# EAGLE design lcd13264-module (EAGLE 6.5.0)
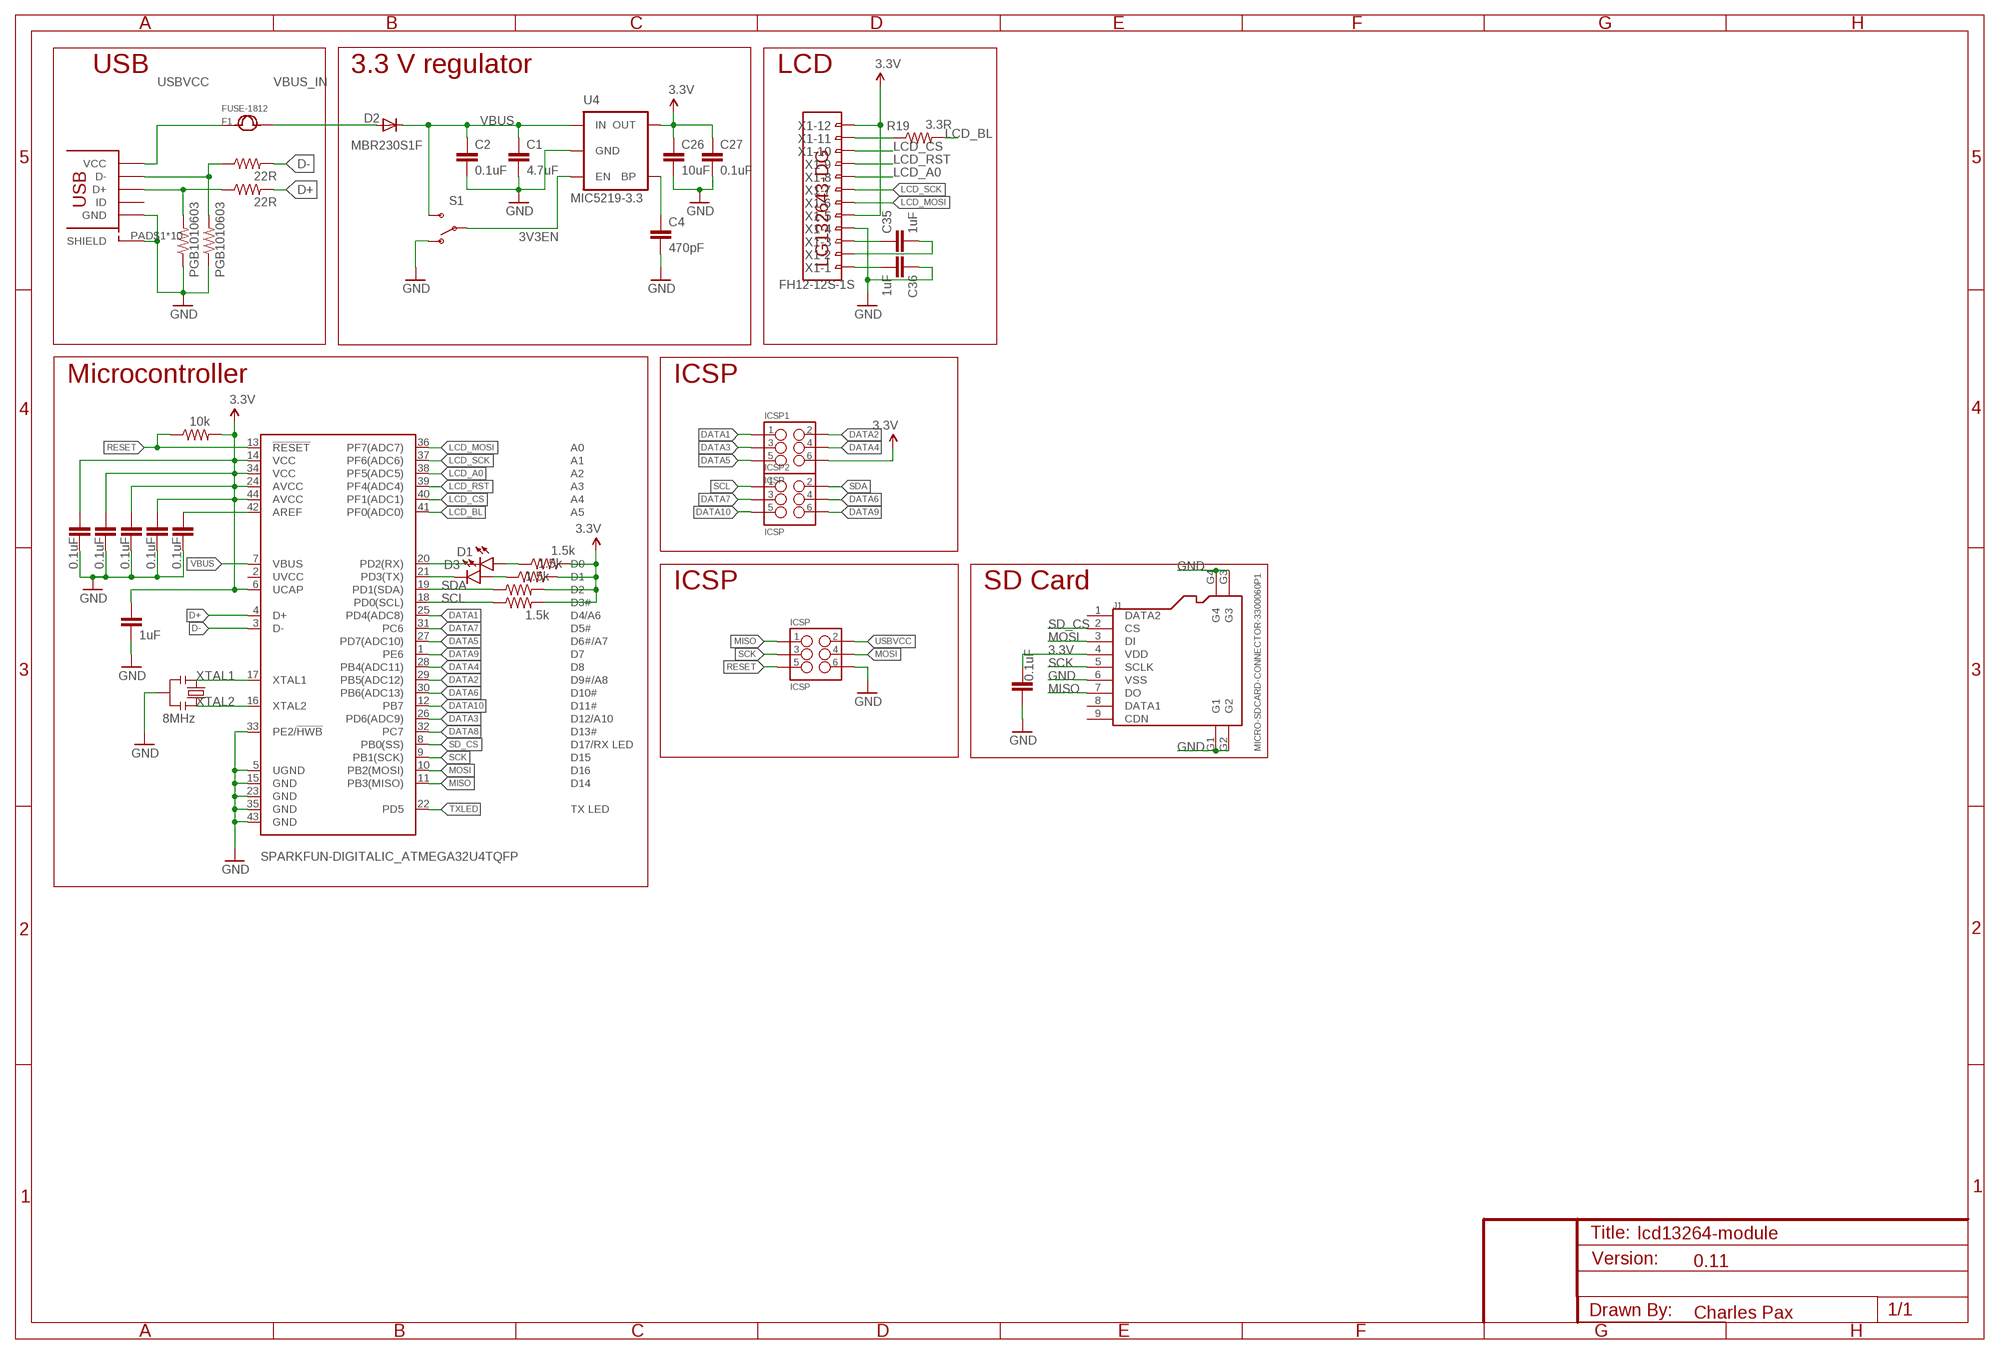
[diagram p0: schematic, sheet 1]

## Parts
C1  4.7uF  SPARKFUN-CAPACITORS_CAP0603-CAP  [SPARKFUN-CAPACITORS_0603-CAP]
C2  0.1uF  SPARKFUN-CAPACITORS_CAP0603-CAP  [SPARKFUN-CAPACITORS_0603-CAP]
C3  0.1uF  SPARKFUN-CAPACITORS_CAP0603-CAP  [SPARKFUN-CAPACITORS_0603-CAP]
C4  470pF  SPARKFUN-CAPACITORS_CAP0603-CAP  [SPARKFUN-CAPACITORS_0603-CAP]
C5  0.1uF  SPARKFUN-CAPACITORS_CAP0603-CAP  [SPARKFUN-CAPACITORS_0603-CAP]
C19  1uF  SPARKFUN-CAPACITORS_CAP0603-CAP  [SPARKFUN-CAPACITORS_0603-CAP]
C21  0.1uF  SPARKFUN-CAPACITORS_CAP0603-CAP  [SPARKFUN-CAPACITORS_0603-CAP]
C26  10uF  SPARKFUN-CAPACITORS_CAP0603-CAP  [SPARKFUN-CAPACITORS_0603-CAP]
C27  0.1uF  SPARKFUN-CAPACITORS_CAP0603-CAP  [SPARKFUN-CAPACITORS_0603-CAP]
C32  0.1uF  SPARKFUN-CAPACITORS_CAP0603-CAP  [SPARKFUN-CAPACITORS_0603-CAP]
C33  0.1uF  SPARKFUN-CAPACITORS_CAP0603-CAP  [SPARKFUN-CAPACITORS_0603-CAP]
C34  0.1uF  SPARKFUN-CAPACITORS_CAP0603-CAP  [SPARKFUN-CAPACITORS_0603-CAP]
C35  1uF  SPARKFUN-CAPACITORS_CAP0603-CAP  [SPARKFUN-CAPACITORS_0603-CAP]
C36  1uF  SPARKFUN-CAPACITORS_CAP0603-CAP  [SPARKFUN-CAPACITORS_0603-CAP]
D1  LED0603  [LED-0603]
D2  MBR230S1F  SPARKFUN-DISCRETESEMI_DIODESOD123SOD123  [SOD123]
D3  LED0603  [LED-0603]
F1  FUSE-1812  [F1812]
ICSP  ICSP  SPARKFUN-CONNECTORS_M03X2PAX  [SPARKFUN-CONNECTORS_2X3_SMT_POSTS_PAXINSTRUMENT]
ICSP1  ICSP  SPARKFUN-CONNECTORS_M03X2PAX  [SPARKFUN-CONNECTORS_2X3_SMT_POSTS_PAXINSTRUMENT]
ICSP2  ICSP  SPARKFUN-CONNECTORS_M03X2PAX  [SPARKFUN-CONNECTORS_2X3_SMT_POSTS_PAXINSTRUMENT]
J1  MICRO-SDCARD-CONNECTOR-3300060P1  [9P-SMD-W-RING]
R1  1.5k  SPARKFUN-RESISTORS_RESISTOR0603-RES  [SPARKFUN-RESISTORS_0603-RES]
R2  1.5k  SPARKFUN-RESISTORS_RESISTOR0603-RES  [SPARKFUN-RESISTORS_0603-RES]
R4  10k  SPARKFUN-RESISTORS_RESISTOR0603-RES  [SPARKFUN-RESISTORS_0603-RES]
R9  22R  SPARKFUN-RESISTORS_RESISTOR0603-RES  [SPARKFUN-RESISTORS_0603-RES]
R10  22R  SPARKFUN-RESISTORS_RESISTOR0603-RES  [SPARKFUN-RESISTORS_0603-RES]
R13  1.5k  SPARKFUN-RESISTORS_RESISTOR0603-RES  [SPARKFUN-RESISTORS_0603-RES]
R14  1.5k  SPARKFUN-RESISTORS_RESISTOR0603-RES  [SPARKFUN-RESISTORS_0603-RES]
R19  3.3R  SPARKFUN-RESISTORS_RESISTOR0603-RES  [SPARKFUN-RESISTORS_0603-RES]
S1  SWITCH-SPDT-SMD-A  [SWITCH-SPST-SMD-A]
U4  MIC5219-3.3V  V_REG_LDOSMD  [SOT23-5]
U$1  USB_MICROSMT+THRUHULE  [USB_MICRO_THRUHOLE]
U$3  SPARKFUN-DIGITALIC_ATMEGA32U4TQFP  [SPARKFUN-DIGITALIC_SPARKFUN-DIGITALIC_TQFP44]
U$5  LG132643-DG  [LG132643-DG]
X1  FH12-12S-1S  [FH12-12S-1SH]
Y1  RESONATORSMD  [RESONATOR-SMD]
Z1  PGB1010603  SPARKFUN-RESISTORS_RESISTOR0603-RES  [SPARKFUN-RESISTORS_0603-RES]
Z2  PGB1010603  SPARKFUN-RESISTORS_RESISTOR0603-RES  [SPARKFUN-RESISTORS_0603-RES]

## Nets
3.3V: C5.1 C19.1 C21.2 C26.1 C27.1 C32.1 C33.1 C34.1 ICSP1.6 J1.4(VDD) R1.2 R2.2 R4.2 R13.2 R14.2 U4.5(OUT) U$3.6(UCAP) U$3.14(VCC) U$3.24(AVCC) U$3.34(VCC) U$3.44(AVCC) X1.5 X1.12
3V3EN: S1.2(P) U4.3(EN)
D+: R9.2 U$3.4(D+)
D-: R10.2 U$3.3(D-)
DATA1: ICSP1.1 U$3.25(PD4(ADC8))
DATA2: ICSP1.2 U$3.29(PB5(ADC12))
DATA3: ICSP1.3 U$3.26(PD6(ADC9))
DATA4: ICSP1.4 U$3.28(PB4(ADC11))
DATA5: ICSP1.5 U$3.27(PD7(ADC10))
DATA6: ICSP2.4 U$3.30(PB6(ADC13))
DATA7: ICSP2.3 U$3.31(PC6)
DATA8: U$3.32(PC7)
DATA9: ICSP2.6 U$3.1(PE6)
DATA10: ICSP2.5 U$3.12(PB7)
GND: C1.2 C2.2 C3.2 C4.2 C5.2 C19.2 C21.1 C26.2 C27.2 C32.2 C33.2 C34.2 C36.1 ICSP.6 J1.6(VSS) J1.G1 J1.G2 J1.G3 J1.G4 S1.1(O) U4.2(GND) U$1.PAD$1(SHIELD) U$1.PAD$2(SHIELD) U$1.PAD$3(SHIELD) U$1.PAD$4(SHIELD) U$1.PAD$5(SHIELD) U$1.PAD$6(SHIELD) U$1.PAD$7(SHIELD) U$1.PAD$8(SHIELD) U$1.PAD$9(SHIELD) U$1.PAD$10(SHIELD) U$1.PIN$5(GND) U$3.5(UGND) U$3.15(GND) U$3.23(GND) U$3.33(PE2/!HWB) U$3.35(GND) U$3.43(GND) X1.4 Y1.2 Z1.1 Z2.1
LCD_A0: U$3.38(PF5(ADC5)) X1.8
LCD_BL: R19.2 U$3.41(PF0(ADC0))
LCD_CS: U$3.40(PF1(ADC1)) X1.10
LCD_MOSI: U$3.36(PF7(ADC7)) X1.6
LCD_RST: U$3.39(PF4(ADC4)) X1.9
LCD_SCK: U$3.37(PF6(ADC6)) X1.7
MISO: ICSP.1 J1.7(DO) U$3.11(PB3(MISO))
MOSI: ICSP.4 J1.3(DI) U$3.10(PB2(MOSI))
N$1: C4.1 U4.4(BP)
N$2: D3.C U$3.21(PD3(TX))
N$4: R19.1 X1.11
N$5: D1.C U$3.20(PD2(RX))
N$7: D3.A R1.1
N$10: D1.A R2.1
N$15: C3.1 U$3.42(AREF)
N$31: R10.1 U$1.PIN$2(D-) Z2.2
N$33: R9.1 U$1.PIN$3(D+) Z1.2
N$37: C35.1 X1.3
N$38: C35.2 X1.2
N$39: C36.2 X1.1
RESET: ICSP.5 R4.1 U$3.13(!RESET)
SCK: ICSP.3 J1.5(SCLK) U$3.9(PB1(SCK))
SCL: ICSP2.1 R14.1 U$3.18(PD0(SCL))
SD_CS: J1.2(CS) U$3.8(PB0(SS))
SDA: ICSP2.2 R13.1 U$3.19(PD1(SDA))
TXLED: U$3.22(PD5)
USBVCC [power]: F1.1 ICSP.2 U$1.PIN$1(VCC)
VBUS [power]: C1.1 C2.1 D2.C S1.3(S) U4.1(IN) U$3.7(VBUS)
VBUS_IN [power]: D2.A F1.2
XTAL1: U$3.17(XTAL1) Y1.1
XTAL2: U$3.16(XTAL2) Y1.3
Unconnected: J1.1(DATA2) J1.8(DATA1) J1.9(CDN) U$1.PIN$4(ID) U$3.2(UVCC)

## Notes on the sheet
- USB | 3.3 V regulator | LCD
- MIC5219-3.3
- Microcontroller | ICSP
- ICSP | SD Card
- 8MHz
- 0.11
- Charles Pax

## Library data of the parts
C1 = PaxInstrument-T400:SPARKFUN-CAPACITORS_CAP: Capacitor Standard 0603 ceramic capacitor, and 0.1" leaded capacitor.; MPN: GRM188R60J475KE19D; OC_DIGIKEY: 490-3297-2-ND
C2 C3 C5 C21 C27 C32-C34 = PaxInstrument-T400:SPARKFUN-CAPACITORS_CAP: Capacitor Standard 0603 ceramic capacitor, and 0.1" leaded capacitor.; MPN: CL10B104KO8NNNC; OC_DIGIKEY: 1276-1005-2-ND
C4 = PaxInstrument-T400:SPARKFUN-CAPACITORS_CAP: Capacitor Standard 0603 ceramic capacitor, and 0.1" leaded capacitor.; MPN: C1608X5R1A474K080AA; OC_DIGIKEY: 445-1320-2-ND
C19 C35 C36 = PaxInstrument-T400:SPARKFUN-CAPACITORS_CAP: Capacitor Standard 0603 ceramic capacitor, and 0.1" leaded capacitor.; MPN: LMK107B7105KA-T; OC_DIGIKEY: 587-1242-2-ND
C26 = PaxInstrument-T400:SPARKFUN-CAPACITORS_CAP: Capacitor Standard 0603 ceramic capacitor, and 0.1" leaded capacitor.; MPN: JMK107ABJ106MAHT; OC_DIGIKEY: 587-3383-2-ND
D1 D3 = SparkFun-LED:LED: LEDs Standard schematic elements and footprints for 5mm, 3mm, 1206, and 0603 sized LEDs. 5mm - Spark Fun Electronics SKU : COM-00529 (and others)
D2 = PaxInstrument-T400:SPARKFUN-DISCRETESEMI_DIODE: Diode These are standard reverse protection diodes and small signal diodes. SMA package can handle up to about 1A. SOD-323 can handle about 200mA. What the SOD-323 package when ordering, there are some mfgs out there that are 5-pin packages.; MPN: B340A-13-F; OC_DIGIKEY: B340A-FDICT-ND
F1 = PaxInstrument-T400:FUSE*
ICSP ICSP1 ICSP2 = PaxInstrument-T400:SPARKFUN-CONNECTORS_M03X2: 2x3 .1" header. Shrouded, with keying- CONN-10681 SMT- CONN-11415 Pogo pins- HW-11044; MPN: 95278-101A06LF; OC_DIGIKEY: 609-3487-2-ND
J1 = PaxInstrument-T400:MICRO-SDCARD-CONNECTOR: Micro SD Card
R1 R2 R13 R14 = PaxInstrument-T400:SPARKFUN-RESISTORS_RESISTOR: Resistor Basic schematic elements and footprints for 0603, 1206, and PTH resistors.; MPN: RC0603JR-071K5L; OC_DIGIKEY: 311-1.5KGRTR-ND
R4 = PaxInstrument-T400:SPARKFUN-RESISTORS_RESISTOR: Resistor Basic schematic elements and footprints for 0603, 1206, and PTH resistors.; MPN: RC1608J103CS; OC_DIGIKEY: 1276-5086-2-ND
R9 R10 = PaxInstrument-T400:SPARKFUN-RESISTORS_RESISTOR: Resistor Basic schematic elements and footprints for 0603, 1206, and PTH resistors.; MPN: RC0603JR-0722RL; OC_DIGIKEY: 311-22GRTR-ND
R19 = PaxInstrument-T400:SPARKFUN-RESISTORS_RESISTOR: Resistor Basic schematic elements and footprints for 0603, 1206, and PTH resistors.
S1 = SparkFun-Electromechanical:SWITCH-SPDT: SPDT Switch Simple slide switch, Spark Fun Electronics SKU : COM-00102 DPDT SMT slide switch, AYZ0202, SWCH-08179
U4 = SparkFun:V_REG_LDO: Voltage Regulator LDO Standard 150mA LDO voltage regulator in SOT-23 layout. Micrel part MIC5205. BP (by-pass) pin is used to lower output noise with 470pF cap.; MPN: MIC5219-3.3YM5 TR; OC_DIGIKEY: 576-1281-2-ND
U$1 = blinkinlabs:USB_MICRO; MPN: 10118194-0001LF; OC_DIGIKEY: 609-4618-2-ND
U$3 = PaxInstrument-T400:SPARKFUN-DIGITALIC_ATMEGA32U4: Atmel 44-pin 8-bit Microcontroller with 32KBytes of ISP Flash and USB Controller ----- Please use the QFN-44-NOPAD_1:1 package for the footprint of all boards using a 32U4. Route traces directly away from the pads as much as possible.
U$5 = charlespax:LG132643-DG; MPN: LG132643-DW
X1 = PaxInstrument-T400:FH12-12S-1S
Y1 = SparkFun:RESONATOR: Resonator Small SMD resonator. This is the itty bitty 10/20MHz resonators with built in caps. CSTCE10M0G55 and CSTCE20M0V53. Footprint has been reviewed closely but hasn't been tested yet.; MPN: CSTCE8M00G52-R0; OC_DIGIKEY: 490-5994-2-ND
Z1 Z2 = PaxInstrument-T400:SPARKFUN-RESISTORS_RESISTOR: Resistor Basic schematic elements and footprints for 0603, 1206, and PTH resistors.; MPN: PGB1010603NRHF; OC_DIGIKEY: F4239CT-ND

## Net classes
0 default: width 0.203 mm, drill 0.33 mm
1 power: width 0.305 mm

## Board
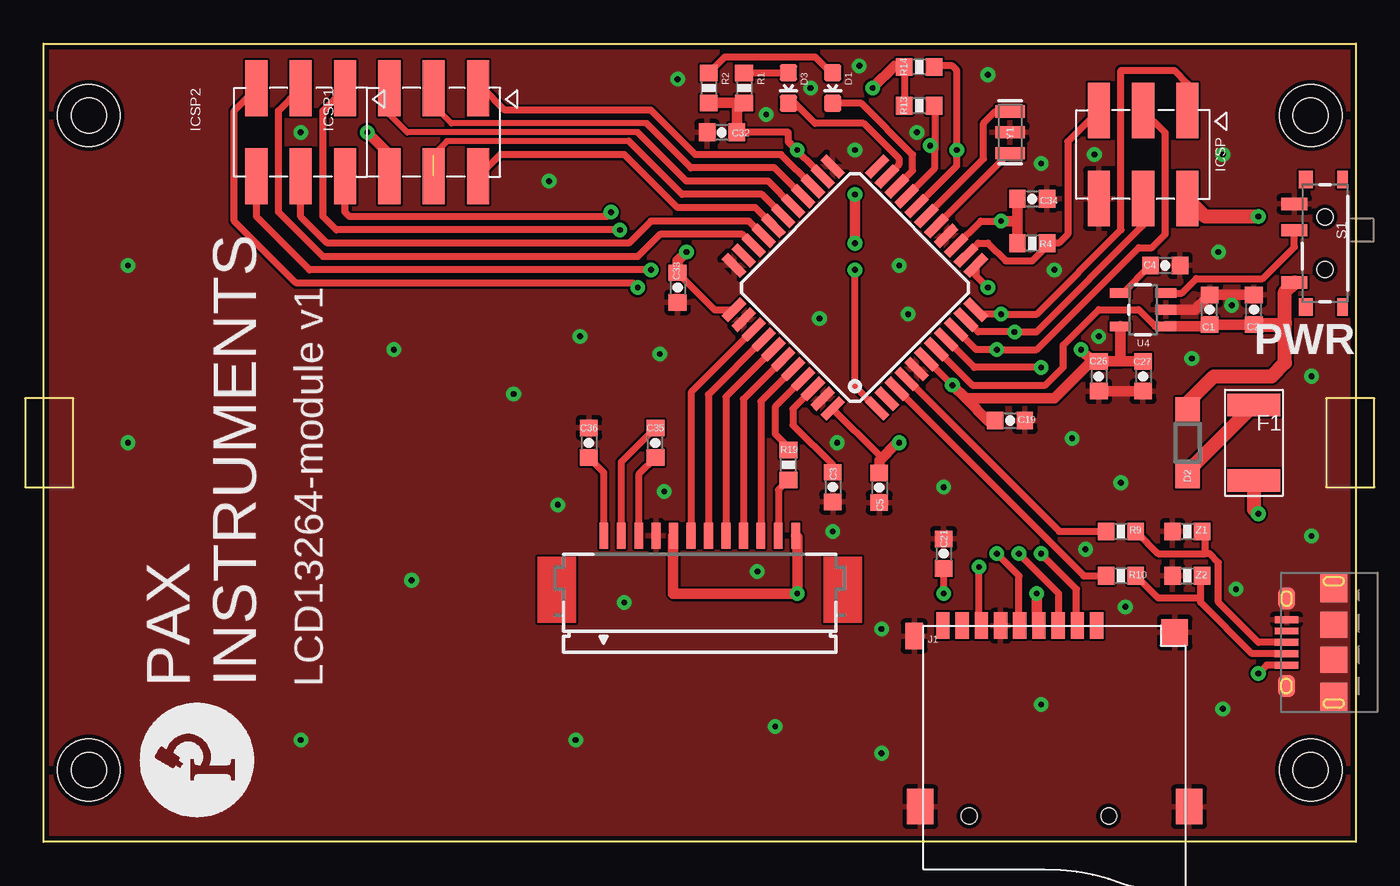
[diagram p1: board, top side]
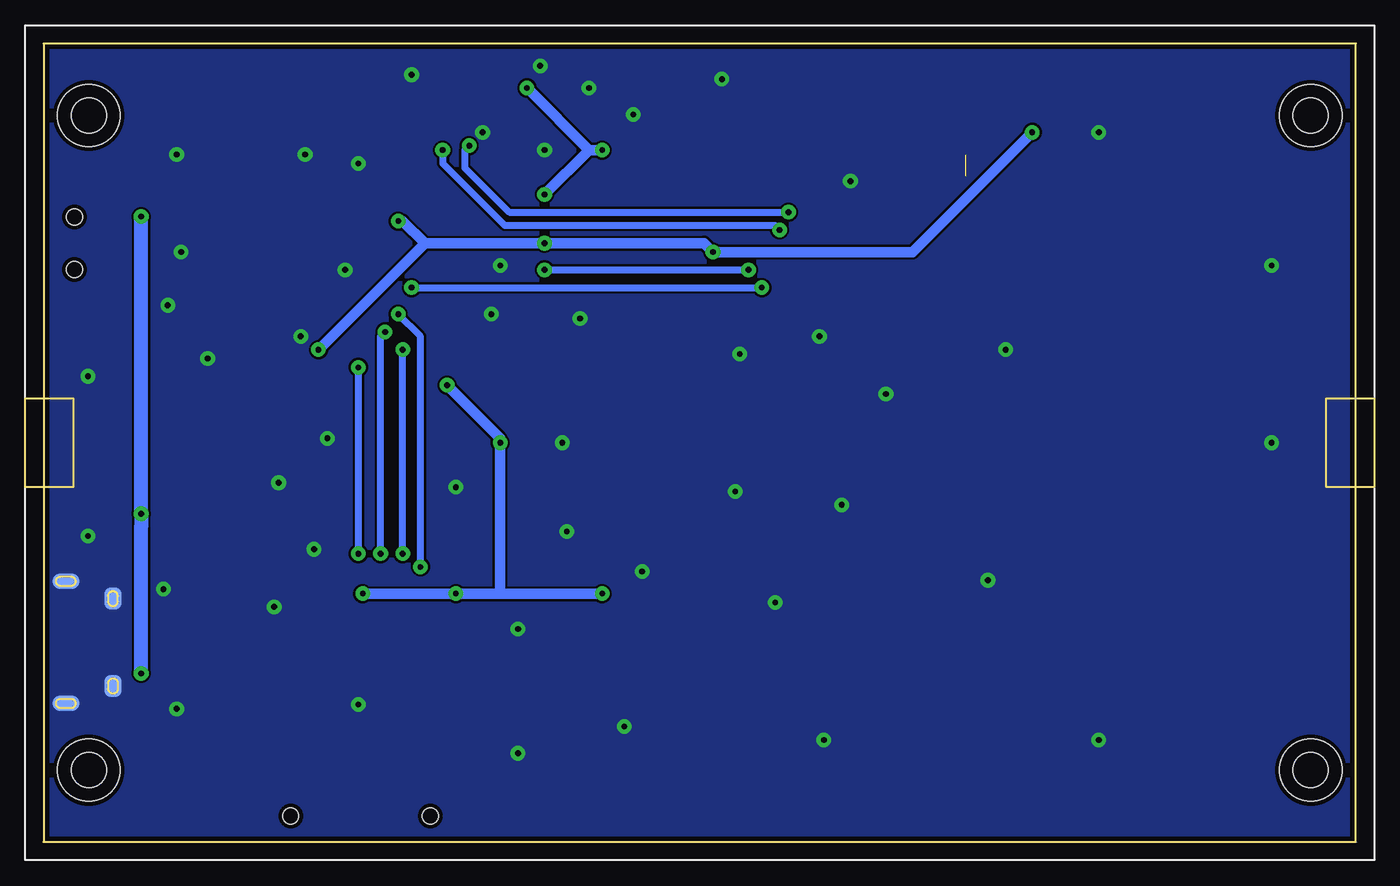
[diagram p2: board, bottom side, seen from below]

Size 75.18 x 45.72 mm. Coordinates in mm from the lower left corner, seen from the top.
Outline: 75.18,0 0,0 0,45.72 75.18,45.72 75.18,0
Copper layers (1*16): Top 0.035mm / dielectric 1.5mm / Bottom 0.035mm
Design rules "PaxInstrument-T400 *": minimum track width 6mil, minimum drill 13mil, track to track 5mil, track to pad 5mil, pad to pad 5mil, via to via 5mil, smd to smd 5mil, copper to edge 10mil, drill to drill 8mil, minimum pad ring 12mil, minimum via ring 10mil, stop-mask expansion 4mil, vias tented up to drill 25mil, thermal gap 10mil
Holes 3.56 mm at 2.59,41.61 2.59,4.11 72.59,4.11 72.59,41.61

### Footprints (pad centres in the part's own frame; a part is rotated, then mirrored left to right if it is on the bottom)
SPARKFUN-CAPACITORS_0603-CAP = smd 0.94 x 1.016: 1 -0.85,0; 2 0.85,0
LED-0603 = smd 1 x 1: A 0,-0.877; C 0,0.877
SOD123 = smd 1.4 x 1.4: A 1.9,0; C -1.9,0
F1812 = smd 1.27 x 3.048: 1 -2.159,0; 2 2.159,0
SPARKFUN-CONNECTORS_2X3_SMT_POSTS_PAXINSTRUMENT = smd 1.27 x 3.2: 1 -2.54,-2.52; 2 -2.54,2.52; 3 0,-2.52; 4 0,2.52; 5 2.54,-2.52; 6 2.54,2.52
9P-SMD-W-RING = smd 1.524 x 0.762: 1 -7.493,2.414; 2 -7.493,1.314; 3 -7.493,0.214; 4 -7.493,-0.886; 5 -7.493,-1.986; 6 -7.493,-3.086; 7 -7.493,-4.186; 8 -7.493,-5.286; 9 -7.493,-6.386 | smd 1.524 x 1.016: G1 -6.893,-8.032 | smd 2.032 x 1.524: G2 2.88,-7.686; G3 2.88,7.714 | smd 1.524 x 1.524: G4 -7.101,6.895 | hole 0.889: 3.407,-4.886; 3.407,3.114
SPARKFUN-RESISTORS_0603-RES = smd 0.94 x 1.016: 1 -0.85,0; 2 0.85,0
SWITCH-SPST-SMD-A = smd 0.7 x 1.5: 1 -2.25,-1.75; 2 -0.75,-1.75; 3 2.25,-1.75 | smd 1 x 0.6: GND1 -3.65,1; GND3 3.65,1 | smd 1 x 0.8: GND2 -3.65,-1.1; GND4 3.65,-1.1 | hole 0.9: -1.5,0; 1.5,0
SOT23-5 = smd 0.55 x 1.2: 1 -0.95,-1.3; 2 0,-1.3; 3 0.95,-1.3; 4 0.95,1.3; 5 -0.95,1.3
USB_MICRO_THRUHOLE = smd 1.645 x 1.55: PAD$1 -3.123,0; PAD$4 3.123,0 | smd 1.5 x 1.55: PAD$2 -1,0; PAD$3 1,0 | smd 1.25 x 0.95: PAD$5 -2.5,2.7; PAD$6 2.5,2.7 | smd 0.9 x 1.55 bottom: PAD$7 -3.5,0; PAD$8 3.5,0 | smd 1.25 x 0.95 bottom: PAD$9 -2.5,2.7; PAD$10 2.5,2.7 | smd 0.4 x 1.35: PIN$1 -1.3,2.7; PIN$2 -0.65,2.7; PIN$3 0,2.7; PIN$4 0.65,2.7; PIN$5 1.3,2.7
SPARKFUN-DIGITALIC_SPARKFUN-DIGITALIC_TQFP44 = smd 1.5 x 0.5: 1 -5.8,4; 2 -5.8,3.2; 3 -5.8,2.4; 4 -5.8,1.6; 5 -5.8,0.8; 6 -5.8,0; 7 -5.8,-0.8; 8 -5.8,-1.6; 9 -5.8,-2.4; 10 -5.8,-3.2; 11 -5.8,-4; 23 5.8,-4; 24 5.8,-3.2; 25 5.8,-2.4; 26 5.8,-1.6; 27 5.8,-0.8; 28 5.8,0; 29 5.8,0.8; 30 5.8,1.6; 31 5.8,2.4; 32 5.8,3.2; 33 5.8,4 | smd 0.5 x 1.5: 12 -4,-5.8; 13 -3.2,-5.8; 14 -2.4,-5.8; 15 -1.6,-5.8; 16 -0.8,-5.8; 17 0,-5.8; 18 0.8,-5.8; 19 1.6,-5.8; 20 2.4,-5.8; 21 3.2,-5.8; 22 4,-5.8; 34 4,5.8; 35 3.2,5.8; 36 2.4,5.8; 37 1.6,5.8; 38 0.8,5.8; 39 0,5.8; 40 -0.8,5.8; 41 -1.6,5.8; 42 -2.4,5.8; 43 -3.2,5.8; 44 -4,5.8
LG132643-DG = hole 2: -35,-18.75; 35,-18.75; 35,18.75; -35,18.75
FH12-12S-1SH = smd 0.5 x 1.5: 1 -5.5,2.297; 2 -4.5,2.297; 3 -3.5,2.297; 4 -2.5,2.297; 5 -1.5,2.297; 6 -0.5,2.297; 7 0.5,2.297; 8 1.5,2.297; 9 2.5,2.297; 10 3.5,2.297; 11 4.5,2.297; 12 5.5,2.297
RESONATOR-SMD = smd 0.7 x 1.7: 1 -1.2,0; 2 0,0; 3 1.2,0

### Placement (x,y rotation side)
C1  66.8,30.48 90 top
C2  69.34,30.48 90 top
C3  45.21,20.32 270 top
C4  64.26,33.02 0 top
C5  47.88,20.29 270 top
C19  55.37,24.13 0 top
C21  51.56,16.51 270 top
C26  60.45,26.67 270 top
C27  62.99,26.67 270 top
C32  38.86,40.64 180 top
C33  36.32,31.75 270 top
C34  56.64,36.83 0 top
C35  35.05,22.86 90 top
C36  31.24,22.86 270 top
D1  45.21,43.18 180 top
D2  65.53,22.86 270 top
D3  42.67,43.18 180 top
F1  69.34,22.86 90 top
ICSP  62.99,39.37 180 top
ICSP1  22.35,40.64 180 top
ICSP2  14.73,40.64 180 top
J1  57.91,4.89 270 top
R1  40.13,43.18 270 top
R2  38.1,43.18 270 top
R4  56.64,34.29 180 top
R9  61.72,17.78 180 top
R10  61.72,15.24 180 top
R13  50.16,42.16 180 top
R14  50.16,44.39 180 top
R19  42.67,21.59 90 top
S1  73.41,34.29 270 top
U4  62.99,30.48 90 top
U$1  73.91,11.43 90 top
U$3  46.48,31.75 135 top
U$5  37.59,22.86 0 top
U$6  [PAXINSTRUMENT_LOGO]  12.19,1.27 90 top
X1  37.59,15.24 0 top
Y1  55.37,40.64 270 top
Z1  65.53,17.78 0 top
Z2  65.53,15.24 0 top

### Tracks (layer width: path | path; a pad name or v marks a point on that pad's centre or on a via)
3.3V  (via drill 0.33)
  Top 0.406: U$3.6 v52.07,26.16 | C5.1 47.88,22.15 U$3.44 | C33.1 38.45,30.48 U$3.34 | U$3.24 42.67,40.08 | 42.67,40.08 42.72,40.08 v43.18,39.62 | U$3.14 53.69,35.56 v54.86,35.56 | C21.2 v51.56,14.22 | C32.1 42.67,40.64 42.67,40.08 | R14.2 R13.2
  Top 0.457: 36.07,17.51 X1.5
  Top 0.61: J1.4 56.9,12.52 v56.9,14.22 | 36.07,17.51 36.07,14.22 v43.18,14.22 43.18,17.45 X1.12 | v49.02,22.86 48.9,22.86 47.88,21.84 C5.1 | C27.1 C26.1 | v52.07,26.16 52.83,25.4 | 52.83,25.4 57.91,25.4 60.03,27.52 60.11,27.52 | C19.1 54.1,24.13 52.83,25.4 | C26.1 60.11,27.52 | 60.11,27.52 v59.44,28.19 | C26.1 61.69,27.52 U4.5 | C34.1 R4.2 55.79,35.39 arc90 55.63,35.56 v54.86,35.56 | v46.48,34.29 v46.48,37.08 | R2.2 R1.2 39.71,41.91 C32.1 | v47.5,43.18 48.77,44.45 48.83,44.39 R14.2 | C33.1 36.32,33.27 v36.83,33.78 | ICSP1.6 19.81,39.37 v18.54,40.64
  Bottom 0.61: v56.9,14.22 v51.56,14.22 49.02,14.22 | 49.02,14.22 v43.18,14.22 | 49.02,14.22 v49.02,22.86 49.02,23.11 v52.07,26.16 | 53.34,34.29 v46.48,34.29 37.34,34.29 v36.83,33.78 25.4,33.78 v18.54,40.64 | v59.44,28.19 53.34,34.29 | v54.86,35.56 54.61,35.56 53.34,34.29 | v46.48,37.08 43.94,39.62 | v43.18,39.62 43.94,39.62 | 43.94,39.62 v47.5,43.18
3V3EN
  Top 0.406: S1.2 71.66,34.06 69.85,32.26 66.04,32.26 65.21,31.43 U4.3
D+
  Top 0.406: U$3.4 58.19,17.78 R9.2
D-
  Top 0.406: U$3.3 59.6,15.24 R10.2
DATA1
  Top 0.406: U$3.25 42.26,39.37 37.34,39.37 34.8,41.91 26.42,41.91 25.17,43.16 ICSP1.1 24.89,42.93
DATA2
  Top 0.406: U$3.29 40.78,36.32 36.32,36.32 33.27,39.37 26.16,39.37 24.91,38.12 ICSP1.2
DATA3
  Top 0.33: 34.54,41.15 23.37,41.15 22.35,42.16 ICSP1.3
  Top 0.406: U$3.26 41.89,38.61 37.08,38.61 34.54,41.15
DATA4  (1 unrouted)
  Top 0.33: 33.53,40.13 23.11,40.13 22.35,39.37
  Top 0.406: U$3.28 41.15,37.08 36.58,37.08 33.53,40.13
DATA5
  Top 0.33: 34.04,40.64 20.83,40.64 19.81,41.66 19.81,42.67
  Top 0.406: 19.81,42.67 ICSP1.5 | U$3.27 41.52,37.85 36.83,37.85 34.04,40.64
DATA6
  Top 0.406: U$3.30 40.41,35.56 34.8,35.56 33.53,34.29 16.26,34.29 14.73,35.81 ICSP2.4
DATA7
  Top 0.406: U$3.31 40.04,34.8 35.31,34.8 34.04,33.53 16,33.53 13.46,36.07 13.46,41.89 ICSP2.3
DATA9  (via drill 0.33)
  Top 0.406: U$3.1 46.48,26.09 v46.48,32.77 | v34.8,32.77 15.24,32.77 12.19,35.81 ICSP2.6
  Bottom 0.406: v46.48,32.77 v34.8,32.77
DATA10  (via drill 0.33)
  Top 0.406: U$3.12 53.41,32.44 v54.1,31.75 | v34.04,31.75 33.78,32 14.48,32 10.92,35.56 10.92,41.89 ICSP2.5
  Bottom 0.406: v54.1,31.75 v34.04,31.75
GND  (via drill 0.33)
  Top 0.61: C2.2 C1.2 65.95,30.48 U4.2 | C27.2 C26.2
  other vias: 68.07,30.73 67.31,33.78 57.91,32.77 49.53,30.23 44.45,29.97 49.02,33.02 46.48,39.62 50.04,40.64 46.74,44.45 43.94,43.18 41.4,41.66 36.32,43.69 54.1,43.94 57.15,38.86 60.2,39.37 67.56,39.37 65.79,27.69 58.93,23.11 45.47,22.86 45.21,17.78 51.56,20.32 59.69,16.76 61.98,13.46 48.01,12.19 40.89,15.49 68.33,14.48 72.64,17.53 72.64,26.67 67.56,7.62 41.91,6.6 30.48,5.84 14.73,5.84 4.83,22.86 4.83,33.02 20.07,28.19 21.08,14.99 26.92,25.65 35.56,20.07 33.27,13.72 29.46,19.3 35.31,27.94 57.15,7.87 48.01,5.08 61.72,20.57 28.96,37.85 14.73,40.64 60.45,28.96 30.73,28.96
  pour Bottom: 74.93,45.47 74.93,0.25 0.25,0.25 0.25,45.47
  pour Top: 74.93,45.47 74.93,0.25 0.25,0.25 0.25,45.47
LCD_A0
  Top 0.406: U$3.38 39.09,25.49 X1.8
LCD_BL
  Top 0.406: U$3.41 41.91,24.91 41.91,23.37 42.67,22.61 R19.2
LCD_CS
  Top 0.406: U$3.40 41.09,25.23 X1.10
LCD_MOSI
  Top 0.406: U$3.36 37.09,25.75 X1.6
LCD_RST
  Top 0.406: U$3.39 40.09,25.36 X1.9
LCD_SCK
  Top 0.406: U$3.37 38.09,25.62 X1.7
MISO  (via drill 0.33)
  Top 0.406: J1.7 53.73,12.82 53.59,12.95 v53.59,15.75 | U$3.11 53.66,30.23 v54.86,30.23 56.9,30.23 61.72,35.05 61.72,44.2 64.77,44.2 65.53,43.43 ICSP.1
  Bottom 0.406: v53.59,15.75 53.59,28.96 v54.86,30.23
MOSI  (via drill 0.33)
  Top 0.406: J1.3 58.13,12.66 58.17,12.7 58.17,14.22 v55.88,16.51 | U$3.10 53.55,29.21 v55.63,29.21 56.9,29.21 62.99,35.31 ICSP.4
  Bottom 0.406: v55.88,16.51 55.88,28.96 v55.63,29.21
N$1
  Top 0.406: U4.4 61.82,31.43 C4.1
N$2
  Top 0.406: U$3.21 49.02,38.81 49.02,39.12 46.99,41.15 44.2,41.15 43.04,42.3 D3.C
N$4
  Top 0.406: R19.1 42.09,20.16 X1.11
N$5
  Top 0.406: U$3.20 49.78,38.45 49.78,39.37 46.85,42.3 D1.C
N$7
  Top 0.406: R1.1 40.16,44.06 D3.A
N$10
  Top 0.406: R2.1 39.03,44.96 44.2,44.96 45.1,44.06 D1.A
N$15
  Top 0.406: U$3.42 42.93,24.8 42.93,23.88 45.21,21.59 C3.1
N$31
  Top 0.406: U$1.PIN$2 69.23,10.78 66.29,13.72 66.29,13.97 | 66.29,13.97 66.29,15.15 Z2.2 | R10.1 63.84,13.97 66.29,13.97
N$33
  Top 0.406: U$1.PIN$3 69.6,11.43 67.31,13.72 67.31,16 66.8,16.51 66.55,16.51 | R9.1 63.84,16.51 66.55,16.51 | 66.55,16.51 66.55,17.61 Z1.2
N$37
  Top 0.406: C35.1 34.09,21.05 X1.3
N$38
  Top 0.406: C35.2 33.09,21.75 X1.2
N$39
  Top 0.406: C36.2 32.09,21.16 X1.1
RESET
  Top 0.406: U$3.13 53.55,34.29 54.1,34.29 55.12,33.27 56.64,33.27 57.49,34.12 R4.1 58.17,34.29 58.67,34.8 58.67,40.11 ICSP.5
SCK  (via drill 0.33)
  Top 0.406: J1.5 55.93,12.91 55.88,12.95 55.88,15.24 v54.61,16.51 | U$3.9 53.43,28.19 v54.61,28.19 56.9,28.19 62.74,34.04 63.5,34.04 64.26,34.8 64.26,40.62 ICSP.3
  Bottom 0.406: v54.61,16.51 v54.61,28.19
SCL  (via drill 0.33)
  Top 0.406: U$3.18 52.32,38.72 v52.32,39.62 52.32,44.2 52.07,44.45 51.08,44.45 R14.1 | v33.02,35.05 16.76,35.05 16,35.81 16,41.89 ICSP2.1
  Bottom 0.406: v52.32,39.62 52.32,38.86 48.77,35.31 33.27,35.31 v33.02,35.05
SD_CS  (via drill 0.33)
  Top 0.406: J1.2 59.23,12.66 59.18,12.7 59.18,14.48 v57.15,16.51 | v57.15,27.18 53.32,27.18 U$3.8
  Bottom 0.406: v57.15,16.51 v57.15,27.18
SDA  (via drill 0.33)
  Top 0.406: U$3.19 51.05,38.58 51.05,39.62 | 51.05,39.62 v50.8,39.88 | 51.05,39.62 51.05,42.12 R13.1 | v32.51,36.07 32.26,35.81 17.53,35.81 17.27,36.07 ICSP2.2
  Bottom 0.406: v50.8,39.88 51.05,39.62 51.05,38.61 48.51,36.07 v32.51,36.07
USBVCC  (via drill 0.33)
  Top 0.406: U$1.PIN$1 70.07,10.13 v69.6,9.65
  Top 0.813: v69.6,35.81 66.57,35.81 ICSP.2 | F1.1 69.34,19.05 v69.6,18.8
  Bottom 0.813: v69.6,9.65 69.6,18.03 v69.6,18.8 v69.6,35.81
VBUS
  Top 0.406: U$3.7 53.2,26.16 57.4,26.16 58.42,27.18 58.42,28.45 60.45,30.48 62.74,30.48 63.69,29.53 U4.1
  Top 0.61: C2.1 C1.1 66.7,29.53 U4.1
  Top 0.813: D2.C 65.53,25.15 67.06,26.67 70.36,26.67 71.12,27.43 71.12,29.72 | 71.12,29.72 71.12,31.5 S1.3 | C2.1 71.03,29.63 71.12,29.72
VBUS_IN
  Top 0.813: D2.A 65.53,21.21 F1.2
XTAL1
  Top 0.406: U$3.17 53.85,39.12 53.85,41.15 54.54,41.84 Y1.1
XTAL2
  Top 0.406: U$3.16 55.3,39.44 Y1.3

### Text on the board
tPlace: PWR | PAX / INSTRUMENTS | LCD13264-module v1